# EAGLE schematic portal (EAGLE 9.6.2)

## Sheet 1 of 2
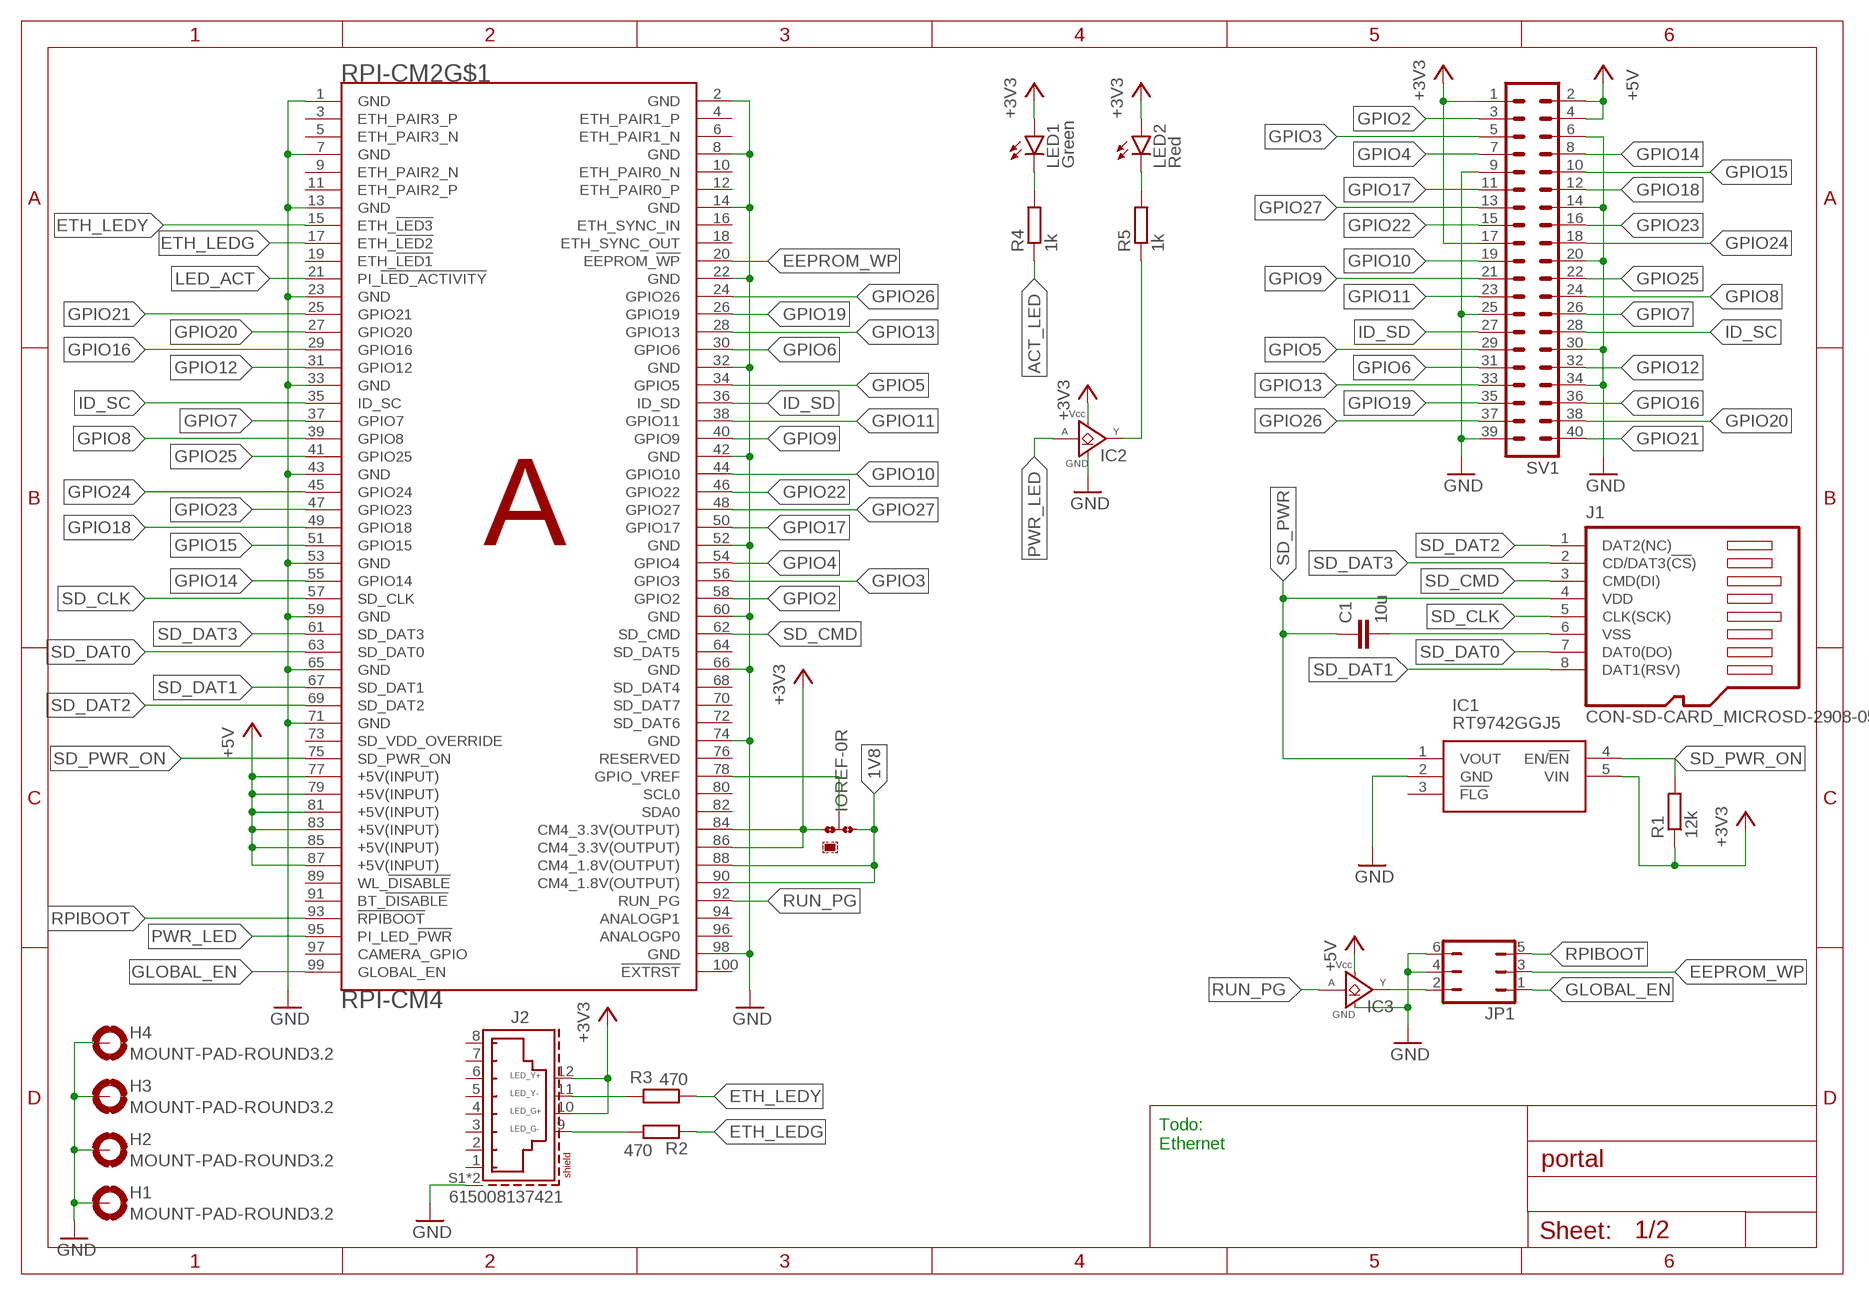
[diagram p0: schematic, sheet 1]

### Parts
C1  10u  C-EUC0805  [C0805]
H1  MOUNT-PAD-ROUND3.2  [3,2-PAD]
H2  MOUNT-PAD-ROUND3.2  [3,2-PAD]
H3  MOUNT-PAD-ROUND3.2  [3,2-PAD]
H4  MOUNT-PAD-ROUND3.2  [3,2-PAD]
IC1  RT9742GGJ5  [SOT94P280X100-5N]
IC2  GHI-IC_SN74LVC1G07DCK  [GHI-IC_SC70(TI-DCK)]
IC3  GHI-IC_SN74LVC1G07DCK  [GHI-IC_SC70(TI-DCK)]
IOREF  0R-JUMPA  [A0R-JMP]
J1  CON-SD-CARD_MICROSD-2908-05  [CON-SD-CARD_2908-05]
J2  615008137421  [615008137421]
JP1  JP3Q  [JP3Q]
LED1  Green  LEDCHIP-LED0805  [CHIP-LED0805]
LED2  Red  LEDCHIP-LED0805  [CHIP-LED0805]
R1  12k  R-EU_R0805  [R0805]
R2  470  R-EU_R0805  [R0805]
R3  470  R-EU_R0805  [R0805]
R4  1k  R-EU_R0805  [R0805]
R5  1k  R-EU_R0805  [R0805]
RPI-CM2  RPI-CM4  [RPI-CM4]
SV1  MA20-2  [MA20-2]

### Nets
1V8: IOREF.3 RPI-CM2.88(CM4_1.8V(OUTPUT)) RPI-CM2.90(CM4_1.8V(OUTPUT))
+3V3: IC1.5(VIN) IC2.5(VCC) IOREF.1 J2.10(G+) J2.12(Y+) LED1.A LED2.A R1.1 RPI-CM2.84(CM4_3.3V(OUTPUT)) RPI-CM2.86(CM4_3.3V(OUTPUT)) SV1.1 SV1.17 ; also sheet 2
+5V: IC3.5(VCC) RPI-CM2.77(+5V(INPUT)) RPI-CM2.79(+5V(INPUT)) RPI-CM2.81(+5V(INPUT)) RPI-CM2.83(+5V(INPUT)) RPI-CM2.85(+5V(INPUT)) RPI-CM2.87(+5V(INPUT)) SV1.2 SV1.4 ; also sheet 2
ACT_LED: R4.1
EEPROM_WP: JP1.3 RPI-CM2.20(EEPROM_!WP)
ETH_LEDG: R2.1 RPI-CM2.17(ETH_!LED2)
ETH_LEDY: R3.1 RPI-CM2.15(ETH_!LED3)
GLOBAL_EN: JP1.1 RPI-CM2.99(GLOBAL_EN)
GND: H1.B3,2(MOUNT) H2.B3,2(MOUNT) H3.B3,2(MOUNT) H4.B3,2(MOUNT) IC1.2(GND) IC2.3(GND) IC3.3(GND) J2.S1(SHIELD) J2.S2(SHIELD) JP1.4 JP1.6 RPI-CM2.1(GND) RPI-CM2.2(GND) RPI-CM2.7(GND) RPI-CM2.8(GND) RPI-CM2.13(GND) RPI-CM2.14(GND) RPI-CM2.22(GND) RPI-CM2.23(GND) RPI-CM2.32(GND) RPI-CM2.33(GND) RPI-CM2.42(GND) RPI-CM2.43(GND) RPI-CM2.52(GND) RPI-CM2.53(GND) RPI-CM2.59(GND) RPI-CM2.60(GND) RPI-CM2.65(GND) RPI-CM2.66(GND) RPI-CM2.71(GND) RPI-CM2.74(GND) RPI-CM2.98(GND) SV1.6 SV1.9 SV1.14 SV1.20 SV1.25 SV1.30 SV1.34 SV1.39 ; also sheet 2
GPIO2: RPI-CM2.58(GPIO2) SV1.3
GPIO3: RPI-CM2.56(GPIO3) SV1.5
GPIO4: RPI-CM2.54(GPIO4) SV1.7
GPIO5: RPI-CM2.34(GPIO5) SV1.29
GPIO6: RPI-CM2.30(GPIO6) SV1.31
GPIO7: RPI-CM2.37(GPIO7) SV1.26
GPIO8: RPI-CM2.39(GPIO8) SV1.24
GPIO9: RPI-CM2.40(GPIO9) SV1.21
GPIO10: RPI-CM2.44(GPIO10) SV1.19
GPIO11: RPI-CM2.38(GPIO11) SV1.23
GPIO12: RPI-CM2.31(GPIO12) SV1.32
GPIO13: RPI-CM2.28(GPIO13) SV1.33
GPIO14: RPI-CM2.55(GPIO14) SV1.8
GPIO15: RPI-CM2.51(GPIO15) SV1.10
GPIO16: RPI-CM2.29(GPIO16) SV1.36
GPIO17: RPI-CM2.50(GPIO17) SV1.11
GPIO18: RPI-CM2.49(GPIO18) SV1.12
GPIO19: RPI-CM2.26(GPIO19) SV1.35
GPIO20: RPI-CM2.27(GPIO20) SV1.38
GPIO21: RPI-CM2.25(GPIO21) SV1.40
GPIO22: RPI-CM2.46(GPIO22) SV1.15
GPIO23: RPI-CM2.47(GPIO23) SV1.16
GPIO24: RPI-CM2.45(GPIO24) SV1.18
GPIO25: RPI-CM2.41(GPIO25) SV1.22
GPIO26: RPI-CM2.24(GPIO26) SV1.37
GPIO27: RPI-CM2.48(GPIO27) SV1.13
ID_SC: RPI-CM2.35(ID_SC) SV1.28
ID_SD: RPI-CM2.36(ID_SD) SV1.27
LED_ACT: RPI-CM2.21(PI_!LED_ACTIVITY)
N$1: J2.9(G-) R2.2
N$2: IOREF.2 RPI-CM2.78(GPIO_VREF)
N$3: J2.11(Y-) R3.2
N$5: LED1.C R4.2
N$6: C1.2 J1.6(VSS)
N$7: LED2.C R5.2
N$8: IC2.4(Y) R5.1
N$12: IC3.4(Y) JP1.2
PWR_LED: IC2.2(A) RPI-CM2.95(PI_LED_!PWR)
RPIBOOT: JP1.5 RPI-CM2.93(!RPIBOOT)
RUN_PG: IC3.2(A) RPI-CM2.92(RUN_PG)
SD_CLK: J1.5(CLK(SCK)) RPI-CM2.57(SD_CLK)
SD_CMD: J1.3(CMD(DI)) RPI-CM2.62(SD_CMD)
SD_DAT0: J1.7(DAT0(DO)) RPI-CM2.63(SD_DAT0)
SD_DAT1: J1.8(DAT1(RSV)) RPI-CM2.67(SD_DAT1)
SD_DAT2: J1.1(DAT2(NC)) RPI-CM2.69(SD_DAT2)
SD_DAT3: J1.2(CD/DAT3(!CS!)) RPI-CM2.61(SD_DAT3)
SD_PWR: C1.1 IC1.1(VOUT) J1.4(VDD)
SD_PWR_ON: IC1.4(EN/!EN) R1.2 RPI-CM2.75(SD_PWR_ON)
Unconnected: IC1.3(!FLG) J1.GND@1(GND) J1.GND@2(GND) J1.GND@3(GND) J1.GND@4(GND) J2.1 J2.2 J2.3 J2.4 J2.5 J2.6 J2.7 J2.8 RPI-CM2.3(ETH_PAIR3_P) RPI-CM2.4(ETH_PAIR1_P) RPI-CM2.5(ETH_PAIR3_N) RPI-CM2.6(ETH_PAIR1_N) RPI-CM2.9(ETH_PAIR2_N) RPI-CM2.10(ETH_PAIR0_N) RPI-CM2.11(ETH_PAIR2_P) RPI-CM2.12(ETH_PAIR0_P) RPI-CM2.16(ETH_SYNC_IN) RPI-CM2.18(ETH_SYNC_OUT) RPI-CM2.19(ETH_!LED1) RPI-CM2.64(SD_DAT5) RPI-CM2.68(SD_DAT4) RPI-CM2.70(SD_DAT7) RPI-CM2.72(SD_DAT6) RPI-CM2.73(SD_VDD_OVERRIDE) RPI-CM2.76(RESERVED) RPI-CM2.80(SCL0) RPI-CM2.82(SDA0) RPI-CM2.89(WL_!DISABLE) RPI-CM2.91(BT_!DISABLE) RPI-CM2.94(ANALOGP1) RPI-CM2.96(ANALOGP0) RPI-CM2.97(CAMERA_GPIO) RPI-CM2.100(!EXTRST)

### Notes on the sheet
- Todo:
  Ethernet

## Sheet 2 of 2
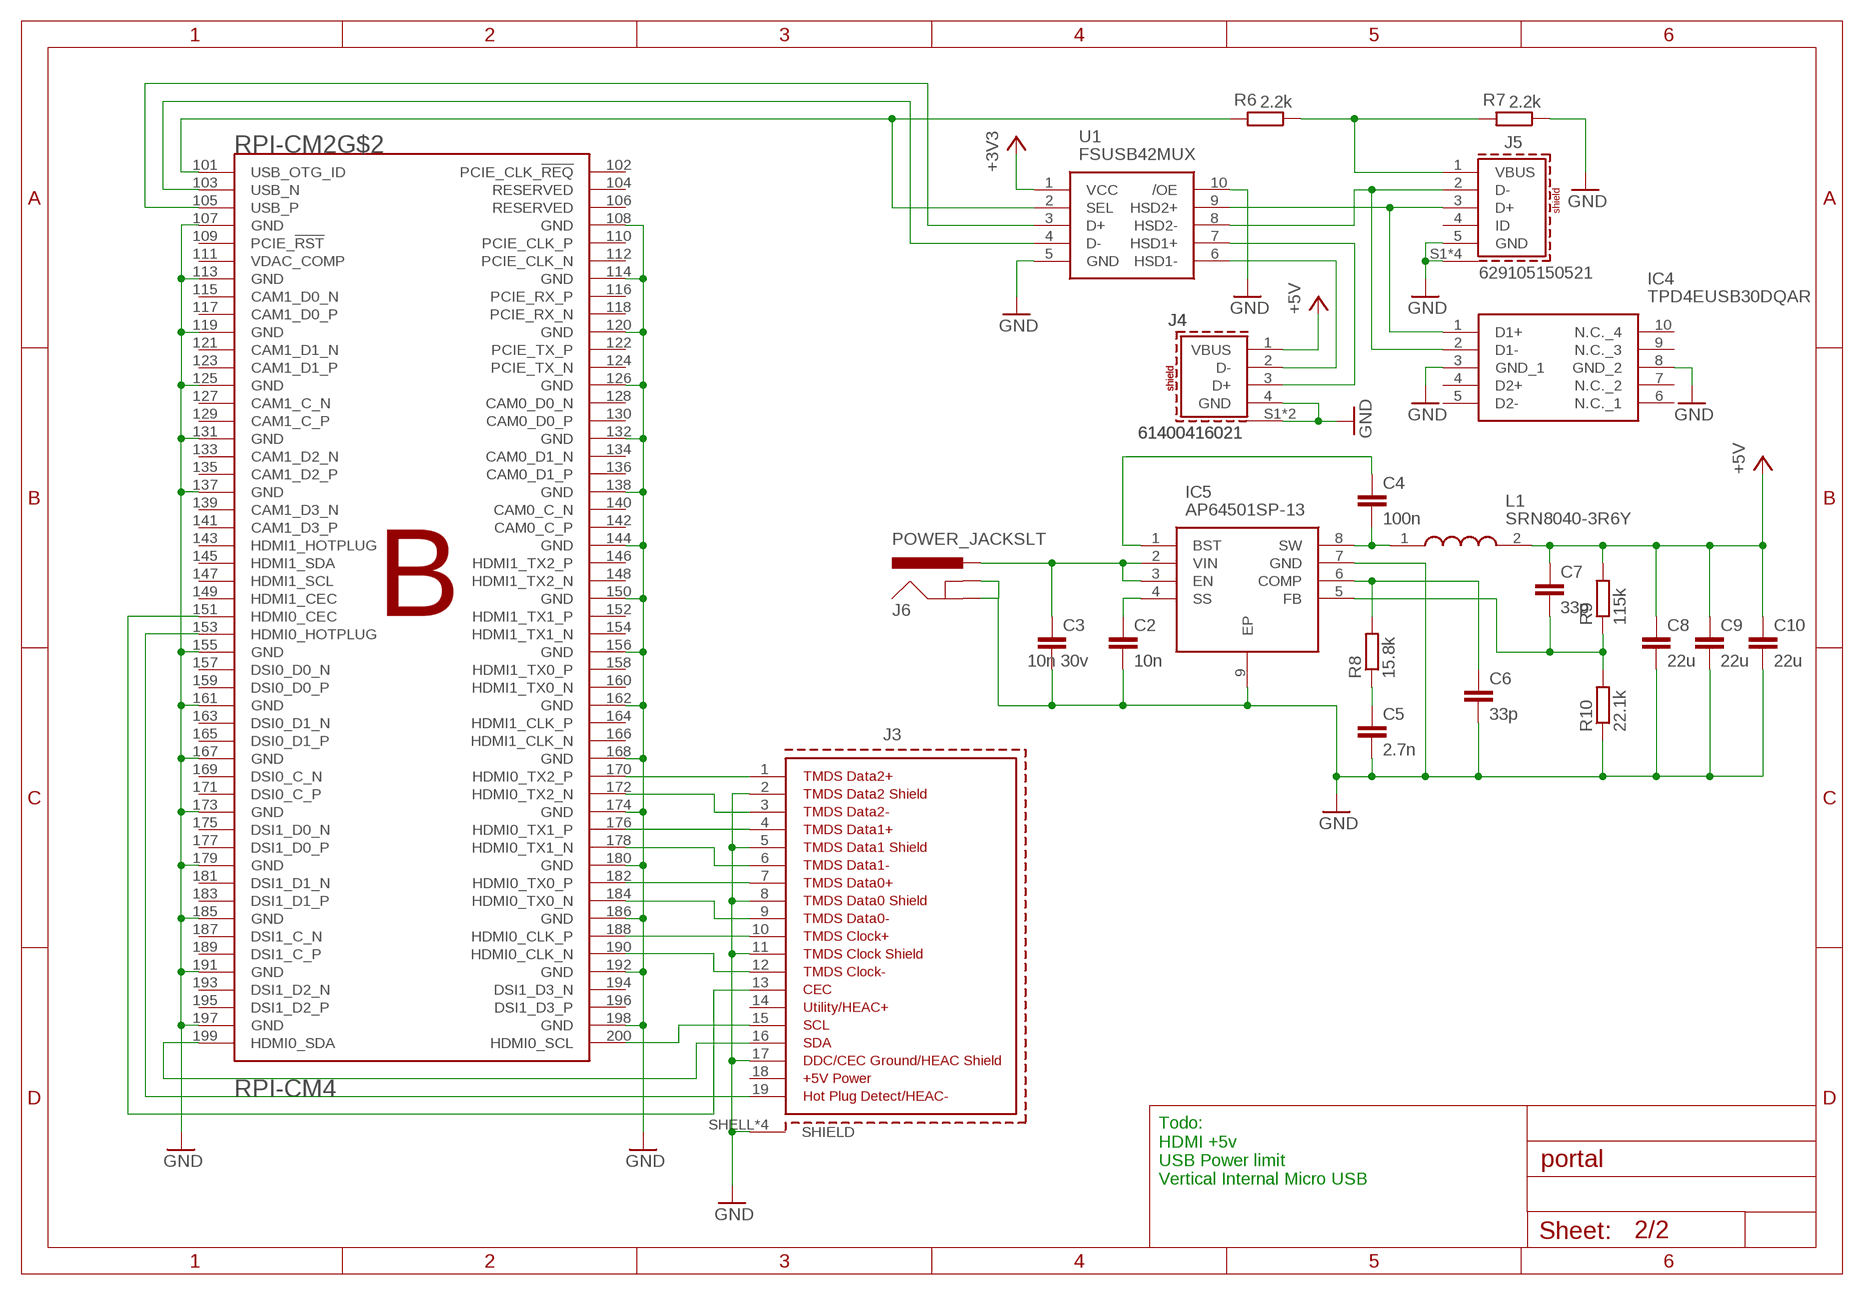
[diagram p1: schematic, sheet 2]

### Parts
C2  10n  C-EUC0805  [C0805]
C3  10n 30v  C-EUC0805  [C0805]
C4  100n  C-EUC0805  [C0805]
C5  2.7n  C-EUC0805  [C0805]
C6  33p  C-EUC0805  [C0805]
C7  33p  C-EUC0805  [C0805]
C8  22u  C-EUC0805  [C0805]
C9  22u  C-EUC0805  [C0805]
C10  22u  C-EUC0805  [C0805]
IC4  TPD4EUSB30DQAR  [DQA(R-PUSON-N10)]
IC5  AP64501SP-13  [SOIC127P600X163-9N]
J3  685119134923  [685119134923]
J4  61400416021  61400416021  [61400416021]
J5  629105150521  [629105150521]
J6  POWER_JACKSLT  [POWER_JACK_SLOT]
L1  SRN8040-3R6Y  [SRN80408R2Y]
R6  2.2k  R-EU_R0805  [R0805]
R7  2.2k  R-EU_R0805  [R0805]
R8  15.8k  R-EU_R0805  [R0805]
R9  115k  R-EU_R0805  [R0805]
R10  22.1k  R-EU_R0805  [R0805]
U1  FSUSB42MUX  [SOP50P490X110-10N]

### Nets
+3V3: U1.1(VCC) ; also sheet 1
+5V: C7.1 C8.1 C9.1 C10.1 J4.1(VBUS) L1.2 R9.2 ; also sheet 1
GND: C2.2 C3.2 C5.2 C6.2 C8.2 C9.2 C10.2 IC4.3(GND_1) IC4.8(GND_2) IC5.7(GND) IC5.9(EP) J3.2(TMDSDATA2SHIELD) J3.5(TMDSDATA1SHIELD) J3.8(TMDSDATA0SHIELD) J3.11(TMDSCLOCKSHIELD) J3.17(DDC/CEC/HECGROUND) J3.SHELL1(SHIELD) J3.SHELL2(SHIELD) J3.SHELL3(SHIELD) J3.SHELL(SHIELD) J4.4(GND) J4.S1(SHIELD) J4.S2(SHIELD) J5.5(GND) J5.S1(SHIELD) J5.S2(SHIELD) J5.S3(SHIELD) J5.S4(SHIELD) J6.GND@1(GNDBREAK) J6.GND@2(GND) R7.1 R10.1 RPI-CM2.107(GND) RPI-CM2.108(GND) RPI-CM2.113(GND) RPI-CM2.114(GND) RPI-CM2.119(GND) RPI-CM2.120(GND) RPI-CM2.125(GND) RPI-CM2.126(GND) RPI-CM2.131(GND) RPI-CM2.132(GND) RPI-CM2.137(GND) RPI-CM2.138(GND) RPI-CM2.144(GND) RPI-CM2.150(GND) RPI-CM2.155(GND) RPI-CM2.156(GND) RPI-CM2.161(GND) RPI-CM2.162(GND) RPI-CM2.167(GND) RPI-CM2.168(GND) RPI-CM2.173(GND) RPI-CM2.174(GND) RPI-CM2.179(GND) RPI-CM2.180(GND) RPI-CM2.185(GND) RPI-CM2.186(GND) RPI-CM2.191(GND) RPI-CM2.192(GND) RPI-CM2.197(GND) RPI-CM2.198(GND) U1.5(GND) U1.10(/OE) ; also sheet 1
N$9: RPI-CM2.103(USB_N) U1.4(D-)
N$10: RPI-CM2.105(USB_P) U1.3(D+)
N$11: IC4.1(D1+) J5.3(D+) U1.9(HSD2+)
N$13: IC4.2(D1-) J5.2(D-) U1.8(HSD2-)
N$14: J4.3(D+) U1.7(HSD1+)
N$15: J4.2(D-) U1.6(HSD1-)
N$16: R6.2 RPI-CM2.101(USB_OTG_ID) U1.2(SEL)
N$17: J3.19(HOTPLUGDETECT/HEAC-) RPI-CM2.153(HDMI0_HOTPLUG)
N$18: J5.1(VBUS) R6.1 R7.2
N$19: J3.13(CEC) RPI-CM2.151(HDMI0_CEC)
N$20: J3.15(SCL) RPI-CM2.200(HDMI0_SCL)
N$21: J3.16(SDA) RPI-CM2.199(HDMI0_SDA)
N$22: J3.3(TMDSDATA2-) RPI-CM2.172(HDMI0_TX2_N)
N$23: J3.10(TMDSCLOCK+) RPI-CM2.188(HDMI0_CLK_P)
N$24: J3.6(TMDSDATA1-) RPI-CM2.178(HDMI0_TX1_N)
N$25: J3.7(TMDSDATA0+) RPI-CM2.182(HDMI0_TX0_P)
N$26: J3.9(TMDSDATA0-) RPI-CM2.184(HDMI0_TX0_N)
N$27: J3.4(TMDSDATA1+) RPI-CM2.176(HDMI0_TX1_P)
N$28: J3.12(TMDSCLOCK-) RPI-CM2.190(HDMI0_CLK_N)
N$29: J3.1(TMDSDATA2+) RPI-CM2.170(HDMI0_TX2_P)
N$30: C3.1 IC5.2(VIN) IC5.3(EN) J6.PWR
N$31: C4.1 IC5.1(BST)
N$32: C2.1 IC5.4(SS)
N$33: C4.2 IC5.8(SW) L1.1
N$34: C6.1 IC5.6(COMP) R8.2
N$35: C5.1 R8.1
N$36: C7.2 IC5.5(FB) R9.1 R10.2
Unconnected: IC4.4(D2+) IC4.5(D2-) IC4.6(N.C._1) IC4.7(N.C._2) IC4.9(N.C._3) IC4.10(N.C._4) J3.14(UTILITY/HEAC+) J5.4(ID) RPI-CM2.102(PCIE_CLK_!REQ) RPI-CM2.104(RESERVED) RPI-CM2.106(RESERVED) RPI-CM2.109(PCIE_!RST) RPI-CM2.110(PCIE_CLK_P) RPI-CM2.111(VDAC_COMP) RPI-CM2.112(PCIE_CLK_N) RPI-CM2.115(CAM1_D0_N) RPI-CM2.116(PCIE_RX_P) RPI-CM2.117(CAM1_D0_P) RPI-CM2.118(PCIE_RX_N) RPI-CM2.121(CAM1_D1_N) RPI-CM2.122(PCIE_TX_P) RPI-CM2.123(CAM1_D1_P) RPI-CM2.124(PCIE_TX_N) RPI-CM2.127(CAM1_C_N) RPI-CM2.128(CAM0_D0_N) RPI-CM2.129(CAM1_C_P) RPI-CM2.130(CAM0_D0_P) RPI-CM2.133(CAM1_D2_N) RPI-CM2.134(CAM0_D1_N) RPI-CM2.135(CAM1_D2_P) RPI-CM2.136(CAM0_D1_P) RPI-CM2.139(CAM1_D3_N) RPI-CM2.140(CAM0_C_N) RPI-CM2.141(CAM1_D3_P) RPI-CM2.142(CAM0_C_P) RPI-CM2.143(HDMI1_HOTPLUG) RPI-CM2.145(HDMI1_SDA) RPI-CM2.146(HDMI1_TX2_P) RPI-CM2.147(HDMI1_SCL) RPI-CM2.148(HDMI1_TX2_N) RPI-CM2.149(HDMI1_CEC) RPI-CM2.152(HDMI1_TX1_P) RPI-CM2.154(HDMI1_TX1_N) RPI-CM2.157(DSI0_D0_N) RPI-CM2.158(HDMI1_TX0_P) RPI-CM2.159(DSI0_D0_P) RPI-CM2.160(HDMI1_TX0_N) RPI-CM2.163(DSI0_D1_N) RPI-CM2.164(HDMI1_CLK_P) RPI-CM2.165(DSI0_D1_P) RPI-CM2.166(HDMI1_CLK_N) RPI-CM2.169(DSI0_C_N) RPI-CM2.171(DSI0_C_P) RPI-CM2.175(DSI1_D0_N) RPI-CM2.177(DSI1_D0_P) RPI-CM2.181(DSI1_D1_N) RPI-CM2.183(DSI1_D1_P) RPI-CM2.187(DSI1_C_N) RPI-CM2.189(DSI1_C_P) RPI-CM2.193(DSI1_D2_N) RPI-CM2.194(DSI1_D3_N) RPI-CM2.195(DSI1_D2_P) RPI-CM2.196(DSI1_D3_P)

### Notes on the sheet
- Todo:
  HDMI +5v
  USB Power limit
  Vertical Internal Micro USB

## Power pins joined to a net without a drawn wire
+5VPOWER: J3.18(+5VPOWER)

## Library data of the parts
C1-C10 = rcl:C-EU: CAPACITOR, European symbol; SPICEPREFIX: C
H1-H4 = holes:MOUNT-PAD-ROUND: MOUNTING PAD, round
IC1 = RT9742GGJ5:RT9742GGJ5: POWER LOAD SWITCH, HIGH SIDE, TSOT-23-5; Power Load Switch Type:High Side; Input Voltage:6V; Current Limit:1.1A; On State Resistance:0.07ohm; Distribution Switch Case Style:TSOT-23; No. of Pins:5Pins; Thermal Protection:Yes; On / RoHS Compliant: Yes Source: Datasheet <https://componentsearchengine.com/Datasheets/2/RT9742GGJ5.pdf>; DESCRIPTION: POWER LOAD SWITCH, HIGH SIDE, TSOT-23-5; Power Load Switch Type:High Side; Input Voltage:6V; Current Limit:1.1A; On State Resistance:0.07ohm; Distribution Switch Case Style:TSOT-23; No. of Pins:5Pins; Thermal Protection:Yes; On / RoHS Compliant: Yes; HEIGHT: 1mm; MANUFACTURER_NAME: RICHTEK; MANUFACTURER_PART_NUMBER: RT9742GGJ5
IC2 IC3 = BeagleBone_Black_Wireless:GHI-IC_SN74LVC1G07DCK
IC4 = TPD4EUSB30DQAR:TPD4EUSB30DQAR: Texas Instruments TPD4EUSB30DQAR, USB Controller, 6Gbit/s, USB 3.0, 10-Pin SON Source: Datasheet <http://www.ti.com/lit/gpn/tpd4eusb30>; ARROW_PART_NUMBER: TPD4EUSB30DQAR; ARROW_PRICE-STOCK: https://www.arrow.com/en/products/tpd4eusb30dqar/texas-instruments; DESCRIPTION: Texas Instruments TPD4EUSB30DQAR, USB Controller, 6Gbit/s, USB 3.0, 10-Pin SON; HEIGHT: mm; MANUFACTURER_NAME: Texas Instruments; MANUFACTURER_PART_NUMBER: TPD4EUSB30DQAR; MOUSER_PART_NUMBER: 595-TPD4EUSB30DQAR; MOUSER_PRICE-STOCK: https://www.mouser.co.uk/ProductDetail/Texas-Instruments/TPD4EUSB30DQAR/?qs=Ze4%2FuFuz19JpY4uqYOLMbQ%3D%3D
IC5 = AP64501SP-13:AP64501SP-13: Conv DC-DC 3.8V to 40V Synchronous Step Down Single-Out 0.8V to 39V 5A 8-Pin SO EP T/R Source: Datasheet <https://www.arrow.com/en/products/ap64501sp-13/diodes-incorporated>; ARROW_PART_NUMBER: AP64501SP-13; ARROW_PRICE-STOCK: https://www.arrow.com/en/products/ap64501sp-13/diodes-incorporated; DESCRIPTION: Conv DC-DC 3.8V to 40V Synchronous Step Down Single-Out 0.8V to 39V 5A 8-Pin SO EP T/R; HEIGHT: 1.63mm; MANUFACTURER_NAME: Diodes Inc.; MANUFACTURER_PART_NUMBER: AP64501SP-13; MOUSER_PART_NUMBER: 621-AP64501SP-13; MOUSER_PRICE-STOCK: https://www.mouser.co.uk/ProductDetail/Diodes-Incorporated/AP64501SP-13/?qs=P1JMDcb91o7FS0GU%252BW7TIQ%3D%3D
IOREF = jump-0r-smd:0R-JUMP: SMD 0R 0805 Jumper
J1 = 52101-101-REV-A_v16:CON-SD-CARD_MICROSD-: microSD Connector
J2 = Wurth_Connectors_WR-MJ:615008137421: WR-MJ Modular Jack Tab Up KIND PROPERTIES Quality Class:750 Mating cycles LED:2xBipolar Y/G; yellow-green General Information Operating Temperature:-40 up to +85 °C Compliance:RoHS Electrical Properties IR1:1.5A Working Voltage:-40 V (AC); 120 V (AC) Withstanding Voltage:1000V (AC) Contact Resistance:20mΩ RISO:500 MΩ Material Properties Insulator MateriaL:PBT Insulator Flammability Rating:UL94 V-0 Color:Black Contact Material:Copper Alloy Contact Plating:Selective Gold Contact Type:Stamped Shielding Material:Bronze Shielding Plating:Nickel Packaging Properties Packaging:Tray <https://www.we-online.com/catalog/media/o33152v209%20Family_WR-MJ_6150081xxx21.jpg> Details see: https://www.we-online.com/catalog/en/MJ_HORIZONTAL_SHIELDED_W_LED_AND_EMI_PANEL_FINGER_8P8C_TAB_UP/ Updated by Yingchun,Shan 2019-11-26 2019 (C) Würth Elektronik; DATASHEET-URL: https://www.we-online.com/catalog/datasheet/615008137421.pdf; LED: yellow-green; MOUNT: THT; PART-NUMBER: 615008137421; TYPE: Horizontal; XPXC: 8P8C
J3 = Wurth_Connectors_WR-HDMI:685119134923: WR-COM HDMI SMT Horizontal <https://www.we-online.com/catalog/media/o33015v209%20Family_WR-COM_685119134923.jpg> Details see: https://www.we-online.com/catalog/en/COM_SMT_HORIZONTAL/ Updated by Ella Wu 2020-01-16 2020(C) Würth Elektronik; DATASHEET-URL: https://www.we-online.com/catalog/datasheet/685119134923.pdf; GERDER: Receptacle; MOUNT: SMT; PART-NUMBER: 685119134923; PINS: 19; RATED-CURRENT: 0.5A; TYPE: Horizontal; WORKING-VOLTAGE: 40VDC
J4 = Wurth_Connectors_WR-USB:61400416021: WR-COM USB 2.0 Type A Horizontal Kind Properties Durability:1 500 Mating cycles Quality Class:1 500 Mating cycles Connector Type:USB Gender:Receptacle Type:Horizontal General Information Operating Temperature:-40up to +105 °C Compliance:RoHS Electrical Properties IR 1:1.5 A Working Voltage:30V (AC) Withstanding Voltage:750 V (AC) Contact Resistance:20 mΩ Material Properties Insulator Material:PBT Insulator Flammability Rating:UL94 V-0 Color:White Cover Material:Brass Cover Plating:Nickel Contact Material:Copper Alloy Contact Plating:Selective Gold Contact Type:Stamped Shielding Material:Brass Shielding Plating:Nickel <https://www.we-online.com/catalog/media/o32983v209%20Family_WR-COM_61400416021.jpg> Details see: https://www.we-online.com/catalog/en/COM_TYPE_A_HORIZONTAL/ Updated by Yingchun, Shan 2020-01-14 2020 (C) Würth Elektronik; APPLICATION: USB 2.0; DATASHEET-URL: https://www.we-online.com/catalog/datasheet/61400416021.pdf; GERDER: Receptacle; INTERFACE-TYPE: Type A; IR1: 1.5A; MOUNT: THT; PACKAGING: Tray; PART-NUMBER: 61400416021; PINS: 4; TYPE: Horizontal; WORKING-VOLTAGE: 30V(AC)
J5 = Wurth_Connectors_WR-USB:629105150521: Type B with Pegs, High Current at Pin 1 & Pin 5 Micro USB 2.0 SMT Type B Horizontal 5 Contacts High Current Kind Properties Durability:10 000 Mating cycles Quality Class:10 000 Mating cycles Connector Type:Micro USB Gender:Receptacle Type:Horizontal General Information Operating Temperature:-40up to +105 °C Compliance:RoHS Electrical Properties IR 1:3A Working Voltage:30V (AC) Withstanding Voltage:100V (AC) Contact Resistance:30 mΩ Material Properties Insulator Material:LCP Insulator Flammability Rating:UL94 V-0 Color:Black Contact Material:Copper Alloy Contact Plating: Gold Contact Type:Stamped Shielding Material:Stainless Steel Shielding Plating:Nickel <https://www.we-online.com/catalog/media/o86333v209%20WR-COM_629105150521_family.jpg> Details see: https://www.we-online.com/catalog/en/COM_MICRO_SMT_TYPE_B_HORIZONTAL_HIGH_CURRENT/ Updated by Ella Wu 2020-08-17 2020 (C) Würth Elektronik; APPLICATION: Micro USB 2.0; DATASHEET-URL: https://www.we-online.com/catalog/datasheet/629105150521.pdf; GERDER: Receptacle; INTERFACE-TYPE: Type B; IR1: 3.0A; MOUNT: SMT; PACKAGING: Tape and Reel; PART-NUMBER: 629105150521; PINS: 5; TYPE: Horizontal; WORKING-VOLTAGE: 30V(AC)
J6 = SparkFun-Connectors:POWER_JACK: Power Jack Connector This is the standard 5.5mm barrel jack for power. The PTH is the most common, proven, reliable, footprint. The Slot footprint only works if the mill layer is transmitted to the PCB fab house so be warned. Here are the connectors we sell at SparkFun: DC Barrel Power Jack/Connector <https://www.sparkfun.com/products/119> (PRT-00119) DC Barrel Power Jack/Connector (SMD) <https://www.sparkfun.com/products/12748> (PRT-12748) DC Barrel Jack Adapter - Breadboard Compatible <https://www.sparkfun.com/products/10811> (PRT-10811) It is used on this SparkFun product (and many, many others): SparkFun RedBoard - Programmed with Arduino <https://www.sparkfun.com/products/12757> (DEV-12757) Also, if you need a mating power supply or connector, please check these out: Wall Adapter Power Supply - 9VDC 650mA <https://www.sparkfun.com/products/298> (TOL-00298) DC Barrel Jack Adapter - Male <https://www.sparkfun.com/products/10287> (PRT-10287); PROD_ID: PRT-00119
JP1 = jumper:JP3Q: JUMPER
L1 = SRN8040-3R6Y:SRN8040-3R6Y: Bourns SRN8040 Series Shielded Wire-wound SMD Inductor with a Ferrite Core, 3.6 uH +/-30% 5.3A Idc Source: Datasheet <https://www.bourns.com/docs/Product-Datasheets/SRN8040.pdf>; ARROW_PART_NUMBER: SRN8040-3R6Y; ARROW_PRICE-STOCK: https://www.arrow.com/en/products/srn8040-3r6y/bourns; DESCRIPTION: Bourns SRN8040 Series Shielded Wire-wound SMD Inductor with a Ferrite Core, 3.6 uH +/-30% 5.3A Idc; HEIGHT: 4mm; MANUFACTURER_NAME: Bourns; MANUFACTURER_PART_NUMBER: SRN8040-3R6Y; MOUSER_PART_NUMBER: 652-SRN8040-3R6Y; MOUSER_PRICE-STOCK: https://www.mouser.com/Search/Refine.aspx?Keyword=652-SRN8040-3R6Y
LED1 LED2 = led:LED: LED OSRAM: - CHIPLED LG R971, LG N971, LY N971, LG Q971, LY Q971, LO R971, LY R971 LH N974, LH R974 LS Q976, LO Q976, LY Q976 LO Q996 - Hyper CHIPLED LW Q18S LB Q993, LB Q99A, LB R99A - SideLED LS A670, LO A670, LY A670, LG A670, LP A670 LB A673, LV A673, LT A673, LW A673 LH A674 LY A675 LS A676, LA A676, LO A676, LY A676, LW A676 LS A679, LY A679, LG A679 - Hyper Micro SIDELED® LS Y876, LA Y876, LO Y876, LY Y876 LT Y87S - SmartLED LW L88C, LW L88S LB L89C, LB L89S, LG L890 LS L89K, LO L89K, LY L89K LS L896, LA L896, LO L896, LY L896 - TOPLED LS T670, LO T670, LY T670, LG T670, LP T670 LSG T670, LSP T670, LSY T670, LOP T670, LYG T670 LG T671, LOG T671, LSG T671 LB T673, LV T673, LT T673, LW T673 LH T674 LS T676, LA T676, LO T676, LY T676, LB T676, LH T676, LSB T676, LW T676 LB T67C, LV T67C, LT T67C, LS T67K, LO T67K, LY T67K, LW E67C LS E67B, LA E67B, LO E67B, LY E67B, LB E67C, LV E67C, LT E67C LW T67C LS T679, LY T679, LG T679 LS T770, LO T770, LY T770, LG T770, LP T770 LB T773, LV T773, LT T773, LW T773 LH T774 LS E675, LA E675, LY E675, LS T675 LS T776, LA T776, LO T776, LY T776, LB T776 LHGB T686 LT T68C, LB T68C - Hyper Mini TOPLED® LB M676 - Mini TOPLED Santana® LG M470 LS M47K, LO M47K, LY M47K Source: http://www.osram.convergy.de LUXEON: - LUMILED® LXK2-PW12-R00, LXK2-PW12-S00, LXK2-PW14-U00, LXK2-PW14-V00 LXK2-PM12-R00, LXK2-PM12-S00, LXK2-PM14-U00 LXK2-PE12-Q00, LXK2-PE12-R00, LXK2-PE12-S00, LXK2-PE14-T00, LXK2-PE14-U00 LXK2-PB12-K00, LXK2-PB12-L00, LXK2-PB12-M00, LXK2-PB14-N00, LXK2-PB14-P00, LXK2-PB14-Q00 LXK2-PR12-L00, LXK2-PR12-M00, LXK2-PR14-Q00, LXK2-PR14-R00 LXK2-PD12-Q00, LXK2-PD12-R00, LXK2-PD12-S00 LXK2-PH12-R00, LXK2-PH12-S00 LXK2-PL12-P00, LXK2-PL12-Q00, LXK2-PL12-R00 Source: www.luxeon.com KINGBRIGHT: KA-3528ASYC Source: www.kingbright.com
R1 = resistor:R-EU_: RESISTOR, European symbol
R2-R10 = rcl:R-EU_: RESISTOR, European symbol; SPICEPREFIX: R
RPI-CM2 = RPI-CM4:RPI-CM4
SV1 = con-lstb:MA20-2: PIN HEADER; OC_FARNELL: unknown; OC_NEWARK: unknown
U1 = FSUSB42MUX:FSUSB42MUX: ON SEMICONDUCTOR - FSUSB42MUX - USB SWITCH, DUAL, DPDT, MSOP-10 Source: Datasheet <https://componentsearchengine.com/Datasheets/2/FSUSB42MUX.pdf>; ARROW_PART_NUMBER: FSUSB42MUX; ARROW_PRICE-STOCK: https://www.arrow.com/en/products/fsusb42mux/on-semiconductor; DESCRIPTION: ON SEMICONDUCTOR - FSUSB42MUX - USB SWITCH, DUAL, DPDT, MSOP-10; HEIGHT: 1.1mm; MANUFACTURER_NAME: ON Semiconductor; MANUFACTURER_PART_NUMBER: FSUSB42MUX; MOUSER_PART_NUMBER: 512-FSUSB42MUX; MOUSER_PRICE-STOCK: https://www.mouser.co.uk/ProductDetail/ON-Semiconductor-Fairchild/FSUSB42MUX?qs=yA6kp8fx8Y59RAD4iJDRWg%3D%3D